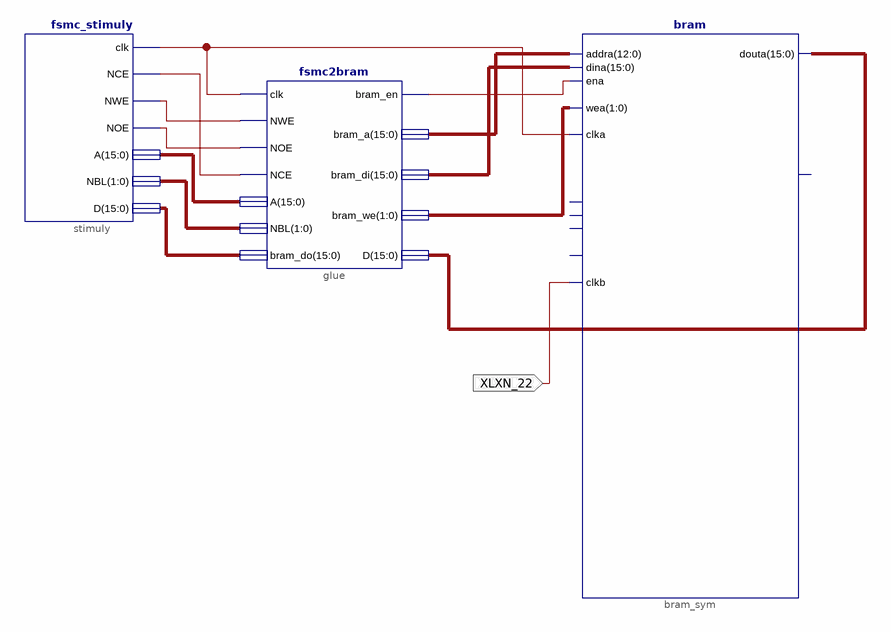
[diagram p0: schematic sheet 1]
// Xilinx ISE schematic fsmc_testbench.sch (spartan6) as structural Verilog: 3 symbols, 1 ports
module fsmc_testbench (
  input  XLXN_22
);

  wire XLXN_24, XLXN_25, XLXN_26, XLXN_34, XLXN_70;
  wire [1:0] XLXN_28, XLXN_35;
  wire [15:0] XLXN_27, XLXN_29, XLXN_32, XLXN_33, XLXN_38;

  fsmc_stimuly stimuly (
    .clk(XLXN_70), .NCE(XLXN_24), .NWE(XLXN_26), .NOE(XLXN_25), .A(XLXN_27), .NBL(XLXN_28), .D(XLXN_29));
  fsmc2bram glue (
    .clk(XLXN_70), .NWE(XLXN_26), .NOE(XLXN_25), .NCE(XLXN_24), .A(XLXN_27), .NBL(XLXN_28),
    .bram_do(XLXN_29), .bram_en(XLXN_34), .bram_a(XLXN_32), .bram_di(XLXN_33), .bram_we(XLXN_35), .D(XLXN_38));
  bram bram_sym (
    .addra(XLXN_32), .dina(XLXN_33), .ena(XLXN_34), .wea(XLXN_35), .clka(XLXN_70), .clkb(XLXN_22),
    .douta(XLXN_38));  // open: addrb, dinb, enb, web, doutb
endmodule
